# Altium schematic sheet Battery-Switch.SchDoc
size A; SheetNumber: 8; SheetTotal: 10
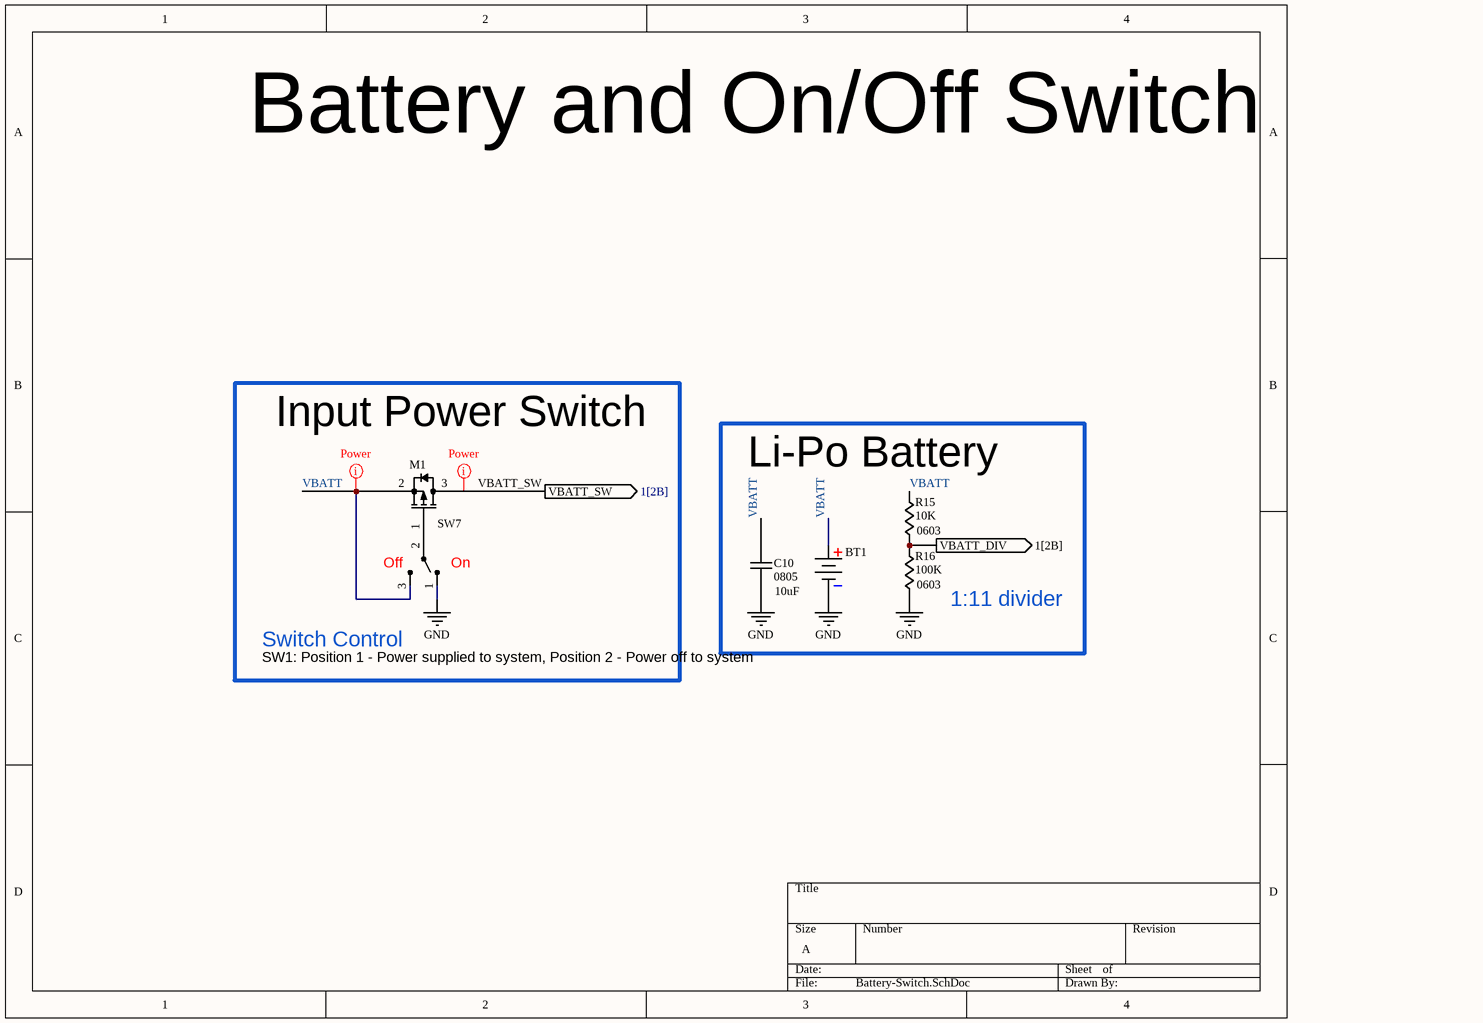
[diagram p0: Battery-Switch.SchDoc]

## Parts
BT1  BATT-JST-S2BPHSM4TBLFSN  [PCB-CONN-JST- S2B-PH-SM4-TB(LF)(SN)-2_V]  (value not drawn)
C10  value 10uF  Footprint: 0805  [PCB-CAP-SMA-0805]  (hidden comment: CAP-SMD-0805)
M1  TR-MOSFET-P-CH-SOT-23-GENERIC  [PCB-SOT-23]  (value not drawn)
R15  value 10K  Footprint: 0603  [PCB-RES-SMD-0603]  (hidden comment: RES-SMD-0603)
R16  value 100K  Footprint: 0603  [PCB-RES-SMD-0603]  (hidden comment: RES-SMD-0603)
SW7  SWITCH-SPDT-SMD-SSSS811101  [PCB-SPDT_SMT_SSSS811101]  (value not drawn)

## Blocks framed on the sheet
Input Power Switch: M1 SW7
Li-Po Battery: BT1 C10 R15 R16

## Ports
VBATT_DIV (out, see 1[2B]), VBATT_SW (out, see 1[2B])

## Nets
GND: BT1.2 C10.1 R16.2 SW7.1
VBATT: BT1.1 C10.2 M1.2(S) R15.1 SW7.3
VBATT_DIV: R15.2 R16.1 ; port VBATT_DIV
VBATT_SW: M1.3(D) ; port VBATT_SW
NetM1_1: M1.1(G) SW7.2

Not connected (* = marked no-connect by the designer): BT1 MP1 MP2

## Layout directives
net class Power: VBATT, VBATT_SW

## Notes on the sheet
- Battery and On/Off Switch
- (near SW7) Off
- (near SW7) On
- 1:11 divider
- SW1: Position 1 - Power supplied to system, Position 2 - Power off to system
- Switch Control

## Library data of the parts
BT1 = CMP-002-00007-1: Connector Header, PH Series, 2 Position, Side Entry, 2.00mm, Solder, Surface Mount, Natural for connecting to a battery.; Insulation Resistance: 1GR; Contact Resistance: 20mR; Current Rating: 2A; Working Voltage: 100V; Gender: Male; Pitch: 2mm; Number of Contacts: 2; Depth: 8.6mm; Lead Free: Lead Free; Series: PH; Length: 7.9mm; Flammability Rating: UL94 V-0; Max Operating Temperature: 85°C; Contact Material: Tin,Copper Alloy,Bronze,Brass; Reach SVHC Compliant: No; Min Operating Temperature: -25°C; Width: 5mm; Packaging: Tape and Reel; Color: White; Voltage Rating (AC): 100V; Contact Plating: Tin,Copper; Housing Material: Polyamide; Number of Rows: 1; Max Voltage Rating (AC): 100V; Orientation: Right Angle; Voltage Rating: 100V; Max Current Rating: 2A; Housing Color: Beige; Termination: Solder; Height: 9.4mm
C10 = CMP-00007-4: Generic (no part number) 0805 surface mount resistor
M1 = CMP-00035-6: MOSFET P-CH 20V 1.3A SOT-23
R15 R16 = CMP-00002-4: Generic (no part number) 0603 surface mount resistor
SW7 = CMP-067-000002-3: Toggle switch; GateName_1: G$1; DeviceSetName: SWITCH_SPDT; Component Type: Standard; SymbolName_1: SWITCH_SPDT; LibraryName: Adafruit PyGamer; Design Item ID: SWITCH_SPDT; Package: SPDT_SMT_SSSS811101; Pin Count: 3; Source: Adafruit PyGamer.SCHLIB